# Altium schematic sheet PDN.SchDoc
size A4; SheetNumber: 6; SheetTotal: 6
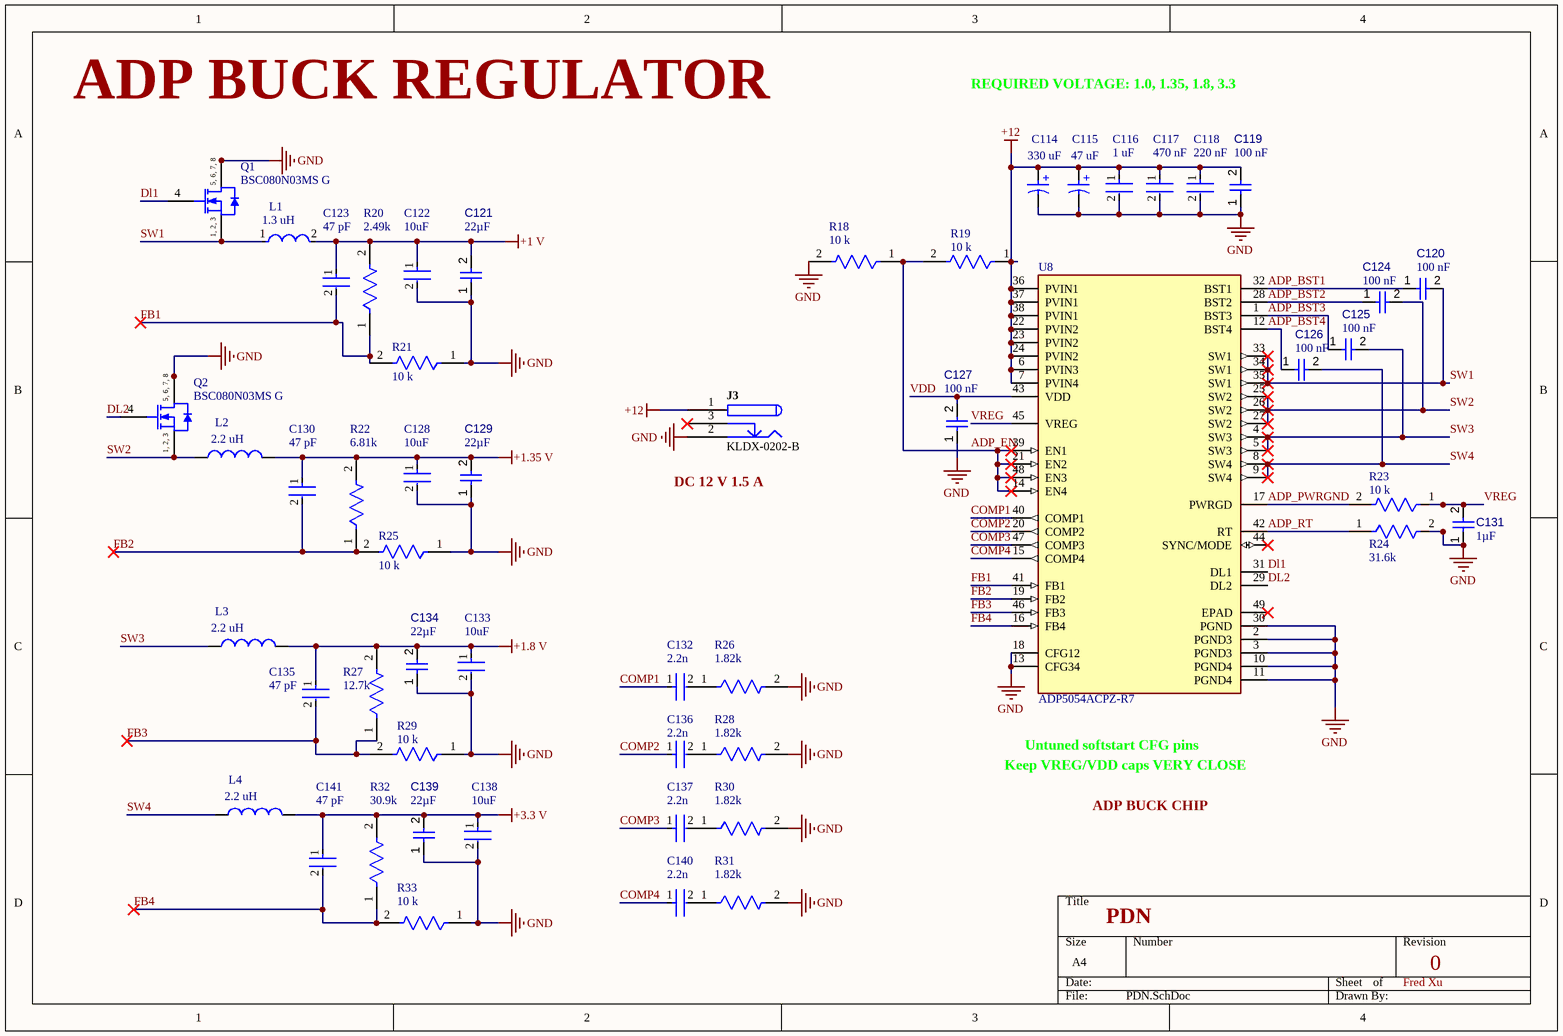
[diagram p0: PDN.SchDoc]

## Parts
C114  330 uF  [WCAP-ATLI_D8H11.5]
C115  47 uF  [WCAP-AT1H_D16H25]
C116  1 uF  [FP-GCM155-0_2-MFG]
C117  470 nF  [FP-GRM155-0_05-IPC_B]
C118  220 nF  [FP-CGA2B-IPC_B]
C119  value 100 nF  [CAPC1005X56X25LL10T15]  (hidden comment: 0.1 uF)
C120  value 100 nF  [CAPC1005X56X25LL10T15]  (hidden comment: 0.1 uF)
C121  value 22µF  [CAPC0805(2012)145_L]  (hidden comment: Capacitor 22µF +/-40% 16V 0805)
C122  10uF  [FP-CL21-IPC_A]
C123  47 pF  [FP-GQM155-0_05-IPC_A]
C124  value 100 nF  [CAPC1005X56X25LL10T15]  (hidden comment: 0.1 uF)
C125  value 100 nF  [CAPC1005X56X25LL10T15]  (hidden comment: 0.1 uF)
C126  value 100 nF  [CAPC1005X56X25LL10T15]  (hidden comment: 0.1 uF)
C127  value 100 nF  [CAPC1005X56X25LL10T15]  (hidden comment: 0.1 uF)
C128  10uF  [FP-CL21-IPC_A]
C129  value 22µF  [CAPC0805(2012)145_L]  (hidden comment: Capacitor 22µF +/-40% 16V 0805)
C130  47 pF  [FP-GQM155-0_05-IPC_A]
C131  value 1µF  [CAPC0603(1608)100_L]  (hidden comment: Capacitor 1µF +/-40% 50V 0603)
C132  2.2n  [FP-C0402-BB-MFG]
C133  10uF  [FP-CL21-IPC_A]
C134  value 22µF  [CAPC0805(2012)145_L]  (hidden comment: Capacitor 22µF +/-40% 16V 0805)
C135  47 pF  [FP-GQM155-0_05-IPC_A]
C136  2.2n  [FP-C0402-BB-MFG]
C137  2.2n  [FP-C0402-BB-MFG]
C138  10uF  [FP-CL21-IPC_A]
C139  value 22µF  [CAPC0805(2012)145_L]  (hidden comment: Capacitor 22µF +/-40% 16V 0805)
C140  2.2n  [FP-C0402-BB-MFG]
C141  47 pF  [FP-GQM155-0_05-IPC_A]
J3  KLDX-0202-B  [KYCN-KLDX-0202-B_V]
L1  1.3 uH  [FP-NR6045-MFG]
L2  2.2 uH  [WE-PMFI_322512]
L3  2.2 uH  [WE-PMFI_322512]
L4  2.2 uH  [WE-PMFI_322512]
Q1  BSC080N03MS G  [INF-PG-TDSON-8-1_V]
Q2  BSC080N03MS G  [INF-PG-TDSON-8-1_V]
R18  10 k  [FP-AC0603-IPC_A]
R19  10 k  [FP-AC0603-IPC_A]
R20  2.49k  [FP-RT0603-MFG]
R21  10 k  [FP-AC0603-IPC_A]
R22  6.81k  [FP-RNCP0603-IPC_A]
R23  10 k  [FP-AC0603-IPC_A]
R24  31.6k  [FP-RMCF0402-IPC_A]
R25  10 k  [FP-AC0603-IPC_A]
R26  1.82k  [FP-CRCW0402-e3-IPC_A]
R27  12.7k  [FP-RP73P-1E-MFG]
R28  1.82k  [FP-CRCW0402-e3-IPC_A]
R29  10 k  [FP-AC0603-IPC_A]
R30  1.82k  [FP-CRCW0402-e3-IPC_A]
R31  1.82k  [FP-CRCW0402-e3-IPC_A]
R32  30.9k  [FP-RK73H1E-IPC_C]
R33  10 k  [FP-AC0603-IPC_A]
U8  ADP5054ACPZ-R7  [FP-CP-48-16-IPC_C]

## Nets
+1 V: C121.2 C122.1 C123.1 L1.2 R20.2
+1.8 V: C133.1 C134.2 C135.1 L3.2 R27.2
+1.35 V: C128.1 C129.2 C130.1 L2.2 R22.2
+3.3 V: C138.1 C139.2 C141.1 L4.2 R32.2
+12: C114.1(P) C115.1(P) C116.1 C117.1 C118.1 C119.2 J3.1 R19.1 U8.6(PVIN3) U8.7(PVIN4) U8.22(PVIN2) U8.23(PVIN2) U8.24(PVIN2) U8.36(PVIN1) U8.37(PVIN1) U8.38(PVIN1)
GND: C114.2(N) C115.2(N) C116.2 C117.2 C118.2 C119.1 C121.1 C122.2 C127.1 C128.2 C129.1 C131.1 C133.2 C134.1 C138.2 C139.1 J3.2 Q1.5(DRAIN) Q1.6(DRAIN) Q1.7(DRAIN) Q1.8(DRAIN) Q2.5(DRAIN) Q2.6(DRAIN) Q2.7(DRAIN) Q2.8(DRAIN) R18.2 R21.1 R24.2 R25.1 R26.2 R28.2 R29.1 R30.2 R31.2 R33.1 U8.2(PGND3) U8.3(PGND3) U8.10(PGND4) U8.11(PGND4) U8.13(CFG34) U8.18(CFG12) U8.30(PGND)
ADP_BST1: C120.1 U8.32(BST1)
ADP_BST2: C124.1 U8.28(BST2)
ADP_BST3: C125.1 U8.1(BST3)
ADP_BST4: C126.1 U8.12(BST4)
ADP_EN: R18.1 R19.2 U8.14(EN4) U8.21(EN2) U8.39(EN1) U8.48(EN3)
ADP_PWRGND: R23.2 U8.17(PWRGD)
ADP_RT: R24.1 U8.42(RT)
COMP1: C132.1 U8.40(COMP1)
COMP2: C136.1 U8.20(COMP2)
COMP3: C137.1 U8.47(COMP3)
COMP4: C140.1 U8.15(COMP4)
Dl1: Q1.4(GATE) U8.31(DL1)
DL2: Q2.4(GATE) U8.29(DL2)
FB1: C123.2 R20.1 R21.2 U8.41(FB1)
FB2: C130.2 R22.1 R25.2 U8.19(FB2)
FB3: C135.2 R27.1 R29.2 U8.46(FB3)
FB4: C141.2 R32.1 R33.2 U8.16(FB4)
SW1: C120.2 L1.1 Q1.1(SOURCE) Q1.2(SOURCE) Q1.3(SOURCE) U8.33(SW1) U8.34(SW1) U8.35(SW1)
SW2: C124.2 L2.1 Q2.1(SOURCE) Q2.2(SOURCE) Q2.3(SOURCE) U8.25(SW2) U8.26(SW2) U8.27(SW2)
SW3: C125.2 L3.1 U8.4(SW3) U8.5(SW3)
SW4: C126.2 L4.1 U8.8(SW4) U8.9(SW4)
VDD: C127.2 U8.43(VDD)
VREG: C131.2 R23.1 U8.45(VREG)
NetC132_2: C132.2 R26.1
NetC136_2: C136.2 R28.1
NetC137_2: C137.2 R30.1
NetC140_2: C140.2 R31.1

Not connected (* = marked no-connect by the designer): J3 3*; U8 44(SYNC/MODE)* 49(EPAD)*

## Notes on the sheet
- ADP BUCK REGULATOR
- REQUIRED VOLTAGE: 1.0, 1.35, 1.8, 3.3
- (near J3) DC 12 V 1.5 A
- Keep VREG/VDD caps VERY CLOSE
- Untuned softstart CFG pins
- ADP BUCK CHIP
- PDN
- Fred Xu
- 0
- (in symbol CMP-1090-00049-1) 5, 6, 7, 8; 1, 2, 3
- (in symbol CMP-03913-53914402-2) +
- (in symbol CMP-03913-129129310-2) +

## Library data of the parts
C114 = CMP-03913-53914402-2: Manufacturer Lifecycle Status: ACTIVE; Pitch: 3.5mm; YEOL: 1 = Estimated lifetime > 10 years; Voltage Rating: 35V; Impedance: 150mΩ; Tolerance: 20%; Polarity: Polar; Leakage Current: 35µA; Ripple Current: 560mA; Life (Hours): 3000hours; Capacitance: 100µF; Lead Pitch: 3.5052mm; Diameter: 8mm; Lifecycle Status: Production; RoHS: Compliant; Height - Seated (Max): 13.0048mm; Mount: Through Hole; Length: 11.5mm; Min Operating Temperature: -55°C; Packaging: Tape & Box (TB); Case/Package: Radial; Max Operating Temperature: 105°C
C115 = CMP-03913-129129310-2: Cap, 47Uf, 400V, Alu Elec, Radial Rohs Compliant: Yes; Capacitance: 47µF; Ripple Current: 1.2A; Hole Diameter: 1.1mm; Leakage Current: 852µA; Pitch: 7.5mm; RoHS: Compliant; Min Operating Temperature: -40°C; Diameter: 16mm; Max Operating Temperature: 105°C; Length: 25mm; Voltage Rating: 400V
C116 = CMP-06035-019453-1: Ceramic Capacitor for Automotive 1uF ±20% 10VDC X7S 0402 Paper T/R
C117 = CMP-06035-008909-1: Chip Multilayer Ceramic Capacitors for General Purpose, 0402, 0.47uF, X7R, 15%, 20%, 10V; Capacitance: 470nF; Length: 1mm; Thickness: 500um; Dielectric: X7R; Voltage Rating (DC): 10V; Width: 500um; Tolerance: 20%
C118 = CMP-08246-001380-1: Cap Ceramic 220nF 25V X7R 20% Pad SMD 0402 +125°C Automotive T/R; Voltage Rating: 25V; Case Code (Imperial): 0402; Termination: SMD/SMT; Width: 0.02inch; Case Code (Metric): 1005; Length: 0.039inch; Min Operating Temperature: -55°C; Tolerance: 20%; Dielectric: X7R; Voltage Rating (DC): 25V; Capacitance: 220nF; Case/Package: 0402; Max Operating Temperature: 125°C; Ratings: AEC-Q200; Weight: 2.3E-05oz; Height: 0.5mm; Packaging: Tape and Reel; Package Quantity: 10000; Thickness: 0.022inch; Mount: Surface Mount
C119 C127 = CMP-001-00001-6: Chip Capacitor, 0.1 uF, +/- 5%, 16 V, 0402 (1005 Metric); Capacitor Type: Ceramic; Voltage Rating: 16V; Max Operating Temperature: 125°C; Min Operating Temperature: -55°C; Case/Package: 0402; Mounting Technology: SM; Pins: 2; Tolerance: 5%; RoHS Compliant: True
C120 C124-C126 = CMP-001-00001-6: Chip Capacitor, 0.1 uF, +/- 5%, 16 V, 0402 (1005 Metric), 0.1-1 ohm ESR, 15 MHz-1nH ESL; Capacitor Type: Ceramic; Voltage Rating: 16V; Max Operating Temperature: 125°C; Min Operating Temperature: -55°C; Case/Package: 0402; Mounting Technology: SM; Pins: 2; Tolerance: 5%; RoHS Compliant: True
C121 C129 C134 C139 = CMP-001-00081-4: Chip Capacitor, 22µF +/-40%, 16V, 0805, Thickness 1.45 mm, 5-50 mOhm,  0.5-2 nH; Tolerance: 5%; Voltage Rating: 16V; Mounting Technology: SMT; Pins: 2; Max Operating Temperature: 85°C; Case/Package: 0805; Min Operating Temperature: -55°C
C122 C128 C133 C138 = CMP-13271-001197-1: CL21 Series 0805 10uF 25V ±10% Tolerance X6S Multilayer Ceramic Chip Capacitor, 5-50 mOhm,  0.5-2 nH; Width: 0.049inch; Case/Package: 0805; Tolerance: 10%; Voltage Rating: 25V; Case Code (Metric): 2012; Voltage Rating (DC): 25V; Min Operating Temperature: -55°C; Capacitance: 10uF; Thickness: 0.057inch; Max Operating Temperature: 105°C; Packaging: Tape and Reel; Case Code (Imperial): 0805; Mount: Surface Mount; Length: 0.079inch
C123 C130 C135 C141 = CMP-06035-010628-1: Ceramic Capacitor 47pF  ±5% 100VDC C0G 0402 Paper T/R; Voltage Rating: 100V; Min Operating Temperature: -55°C; Capacitance: 47pF; Dielectric: C0G; Length: 0.039inch; Mount: Surface Mount; Width: 0.02inch; Voltage Rating (DC): 100V; Thickness: 0.022inch; Packaging: Tape and Reel; Case/Package: 0402; Max Operating Temperature: 125°C; Tolerance: 5%
C131 = CMP-001-00078-4: Chip Capacitor, 1µF +/-40%, 50V, 0603, Thickness 1 mm; Tolerance: 10%; Case/Package: 0603; Pins: 2; Max Operating Temperature: 85°C; Voltage Rating: 50V; Mounting Technology: SMT; Min Operating Temperature: -55°C
C132 C136 C137 C140 = CMP-1034-01736-3: C0402 2,200 pF C0G 0.02 25 V; Manufacturer Part Number: C0402C222G3GACTU; Manufacturer: Kemet; Voltage Rating: 25 V; Tolerance: 0.02; Material: Ceramic; Lead Free: Yes; Device Class L1: Passive Components; Temperature Characteristic: C0G; RoHS: TRUE; Height: 0.55mm; Capacitance: 2,200 pF; ComponentLink2URL: https://content.kemet.com/datasheets/KEM_C1002_X7R_SMD.pdf; ComponentLink2Description: Datasheet; Automotive: No; Value: 2,200 pF; Temperature Range Low: -55°C; Category: Cap; Device Class L3: Ceramic Capacitors; Mouser Description: Multilayer Ceramic Capacitors MLCC - SMD/SMT 25volts 2200pF 2% C0G 0402; Octopart: https://octopart.com/c0402c222g3gactu-kemet-87368565; Device Class L2: Capacitors; Temperature: -55°C to +125°C; Package: C0402-BB; Ipc Land Pattern Name: CAPC10050X50; Temperature Range High: +125°C
J3 = CMP-0256-00001-1: 3 Conductor Power Jack, 2 break 2 aux contacts; ComponentLink2URL: http://anacapa.kycon.com/Catalog_PDF/KLDX_0202.pdf; PackageReference: KLDX-0202-B; Contact Finish: Brass; ComponentLink2Description: Datasheet; Mounting Technology: Through Hole; PackageDescription: Jack, 9 x 14.5 mm Body, 2.5 mm Center Pin Diameter; ComponentLink1Description: Manufacturer URL; PartNumber: KLDX-0202-B; ComponentLink1URL: http://kycon.com/
L1 = CMP-14484-001495-1: Shielded Wirewound Inductor 1.3uH 30% 4A 20.8mΩ SMD; Self Resonant Frequency: 95MHz; Test Frequency: 100kHz; Core Material: Ferrite; DC Resistance (DCR): 20.8mR; Saturation Current: 8A; Tolerance: 30%; Max DC Current: 4A; Halogen Free: Halogen Free; Max Operating Temperature: 120°C; Depth: 6.2mm; RoHS Compliant: Yes; Mount: Surface Mount; Number of Pins: 2; Radiation Hardening: No; Min Operating Temperature: -25°C; Current Rating: 4A; Inductance: 1.3uH; Packaging: Tape and Reel; Resistor Type: Wirewound; Series: NR; Length: 0.236inch; Inductance Tolerance: 30%; Height: 4.5mm; Shielding: Shielded; Height - Seated (Max): 0.177inch; RMS Current (Irms): 4A; Width: 0.236inch; Case/Package: Nonstandard; Package Quantity: 1; Termination: SMD/SMT; REACH SVHC: No SVHC
L2-L4 = CMP-03913-162350128-1: Power Ind, 2.2UH, 4.1A, Shielded, 1210 Rohs Compliant: Yes
Q1 Q2 = CMP-1090-00049-1: N-Channel OptiMOS 3 M-Series Power-MOSFET, 30 V VDS, 53 A ID, -55 to 150 degC, PG-TDSON-8-1, Reel, Green; Manufacturer: Infineon; VGS(th) (min): 1Â V; RthJC (max): 3.6Â K/W; Ptot (max): 35Â W; RDS (on) (max) (@4.5V): 10.2Â mOhm; IDpuls (max): 212Â A; ID (max): 53Â A; Polarity: N; VDS (max): 30Â V; VGS(th) (max): 2Â V; RDS (on) (max): 8Â mOhm; QG: 9.9Â nC; Green: TRUE; RthJA (max): 50 K/W; ComponentLink1Description: Manufacturer URL; ComponentLink2URL: http://www.infineon.com/dgdl/BSC080N03MSG_rev1.15.pdf?folderId=db3a304313d846880113d91d60c500c4&fileId=db3a304313d846880113de6cfd390383; ComponentLink2Description: Datasheet; Mounting Technology: Surface Mount; Packing: Reel; PartNumber: BSC080N03MS G; Rth: 3.6Â K/W; ComponentLink3URL: http://www.infineon.com/cms/packages/SMD_-_Surface_Mounted_Devices/P-PG-TDSON/P-PG-TDSON-08-01x_2x_3.html?__locale=en; PackageReference: PG-TDSON-8-1; PackageDescription: 8-Pin Plastic (Green) Thin Dual Small Outline Non-Leaded Package, 5.15 x 5.9 mm Body, 1.27 mm Pitch; ComponentLink3Description: Package Specification; ComponentLink1URL: http://www.infineon.com/; Halogen-free: TRUE; DatasheetVersion: Rev. 1.15
R18 R19 R21 R23 R25 R29 R33 = CMP-03412-040683-1: RES 10kΩ 5.00% 0.2W 0603
R20 = CMP-2000-04533-2: RES SMD 2.49K OHM 0.1% 1/10W; Manufacturer Part Number: RT0603BRE072K49L; Manufacturer: Yageo; Voltage Rating: 75V; Resistance: 2.49KΩ; Power Rating: 0.1W; Tolerance: 0.001; Temperature Coefficient: 50 ppm/°C; Value: 2.49KΩ; Package: RT0603; Ipc Land Pattern Name: RESC16080X45; Octopart: https://octopart.com/rt0603bre072k49l-yageo-1264492; Lead Free: Yes; Device Class L3: Chip SMD Resistors; Composition: Thin Film; Digikey Description: RES SMD 2.49K OHM 0.1% 1/10W; Device Class L2: Resistors; Temperature: -55°C to +155°C; Footprint Url: http://www.yageo.com/exep/pages/download/literatures/PYu-R_Mount_10.pdf; ComponentLink2Description: Datasheet; Temperature Range Low: -55°C; Category: Res; Device Class L1: Passive Components; ComponentLink2URL: http://www.yageo.com/documents/recent/PYu-RT_1-to-0.01_RoHS_L_9.pdf; Automotive: No; RoHS: TRUE; Height: 0.55mm; Temperature Range High: +155°C; Series: RT
R22 = CMP-26527-000053-1: 6.81kΩ ±1% 0.125W 0603 High Power Anti-Sulfur Thin Film Chip Resistor; Temperature Coefficient: 100ppm/°C; Resistance: 6.81kR; Max Power Dissipation: 125mW; Resistor Type: Thin Film; Radiation Hardening: No; Features: Moisture Resistant; Mount: Surface Mount; Contact Plating: Tin; Case Code (Imperial): 0603; Min Operating Temperature: -55°C; Case/Package: 0603; Tolerance: 1%; Width: 0.031inch; Number of Terminations: 2; Packaging: Tape and Reel; Case Code (Metric): 1608; Max Operating Temperature: 155°C; RoHS Compliant: Yes; Length: 0.059inch; Series: RNCP; Height: 0.02inch
R24 = CMP-26527-007261-1: 31.6kΩ ±1% 0.063W 0402 Thick Film Chip Resistor AEC-Q200 compliant; Temperature Coefficient: 100ppm/°C; Resistance: 31.6kR; Max Power Dissipation: 63mW; RoHS Compliant: Yes; Max Operating Temperature: 155°C; Radiation Hardening: No; Case/Package: 0402; Number of Terminations: 2; Tolerance: 1%; Case Code (Imperial): 0402; Series: RMCF; Depth: 0.5mm; Length: 0.039inch; Case Code (Metric): 1005; Packaging: Tape and Reel; Min Operating Temperature: -55°C; Width: 0.02inch; Lead Free: Lead Free; Features: Automotive AEC-Q200; Height: 0.016inch; Mount: Surface Mount; Resistor Type: Thick Film; Contact Plating: Tin; Construction: Rectangular; Military Standard: Not
R26 R28 R30 R31 = CMP-2002-08310-2: RES Thick Film, 1.82kΩ, 1%, 0.063W, 100ppm/°C, 0402; Voltage Rating (DC): 50V; Power Rating: 63mW; Tolerance: 5%; Resistance: 1.82kR; Composition: Thick Film; Termination: SMD/SMT; Contact Plating: Tin; Case Code (Metric): 1005; Case/Package: 0402; Mount: Surface Mount; Lead Free: Lead Free; Packaging: Tape and Reel; Max Power Dissipation: 63mW; Features: Automotive AEC-Q200; Radiation Hardening: No; Depth: 0.5mm; Voltage Rating: 50V; Temperature Coefficient: 100ppm/°C; Width: 0.02inch; Weight: 2.3E-05oz; Min Operating Temperature: -55°C; Height: 0.016inch; Package Quantity: 10; Case Code (Imperial): 0402; Max Operating Temperature: 155°C; Length: 1mm; Military Standard: Not; Number of Terminations: 2
R27 = CMP-03211-008302-1: RP73P 0402 12.7KΩ 0.1W 25ppm/°C 0.10% 50V; Manufacturer Part Number: RP73PF1E12K7BTD; Manufacturer: TE Connectivity; ComponentLink2Description: Datasheet; Resistance: 12.7KΩ; Category: Res; Temperature Coefficient: 25ppm/°C; Temperature Range Low: -55°C; Device Class L1: Passive Components; Octopart: https://octopart.com/rp73pf1e12k7btd-te+connectivity-89229930; Power Rating: 0.1W; Value: 12.7KΩ; Device Class L2: Resistors; Temperature: -55°C to +155°C; Ipc Land Pattern Name: RESC10050X30; Automotive: No; Voltage Rating: 50V; Tolerance: 0.10%; Composition: Thin Film; RoHS: TRUE; Temperature Range High: +155°C; Height: 0.35mm; ComponentLink2URL: https://www.te.com/commerce/DocumentDelivery/DDEController?Action=srchrtrv&DocNm=1773272&DocType=DS&DocLang=English; Device Class L3: Chip SMD Resistors; Series: RP73P; Lead Free: Yes; Package: RP73P-1E
R32 = CMP-04015-082520-1: 30.9kΩ ±1% 0.1W Chip Resistor 0402 Thick Film AEC-Q200 Qualified; Power Rating: 63mW; Voltage Rating: 50V; Temperature Coefficient: 100ppm/°C; Resistance: 30.9kR; Resistor Type: Thick Film; Max Operating Temperature: 155°C; Width: 0.5mm; Package Quantity: 10000; Lead Free: Contains Lead; Height: 0.35mm; Tolerance: 1%; Military Standard: Not; Series: RK73H; Case Code (Imperial): 0402; Length: 1mm; Termination: SMD/SMT; Depth: 0.5mm; Case Code (Metric): 1005; Min Operating Temperature: -55°C; Packaging: Tape and Reel; Construction: Rectangular; Voltage Rating (DC): 50V; Case/Package: 0402; RoHS Compliant: No
U8 = CMP-09139-000140-1: IC REG CTRLR BUCK 48LFCSP; Number of Outputs: 4; Clock Sync: Yes; Max Input Voltage: 15.5V; Number of Output Phases: 2; Output Type: Fixed; Min Input Voltage: 4.5V; Max Duty Cycle: 50%; Output Configuration: Positive; Switching Frequency: 2MHz; Mount: Surface Mount; RoHS Compliant: Yes; Lead Free: Contains Lead; Max Operating Temperature: 125°C; Number of Pins: 48; Synchronous Rectifier: Yes; Min Operating Temperature: -40°C; Operating Supply Voltage: 15.5V; Packaging: Tape and Reel; Contact Plating: Tin